# EAGLE schematic Electrics (EAGLE 9.6.2)
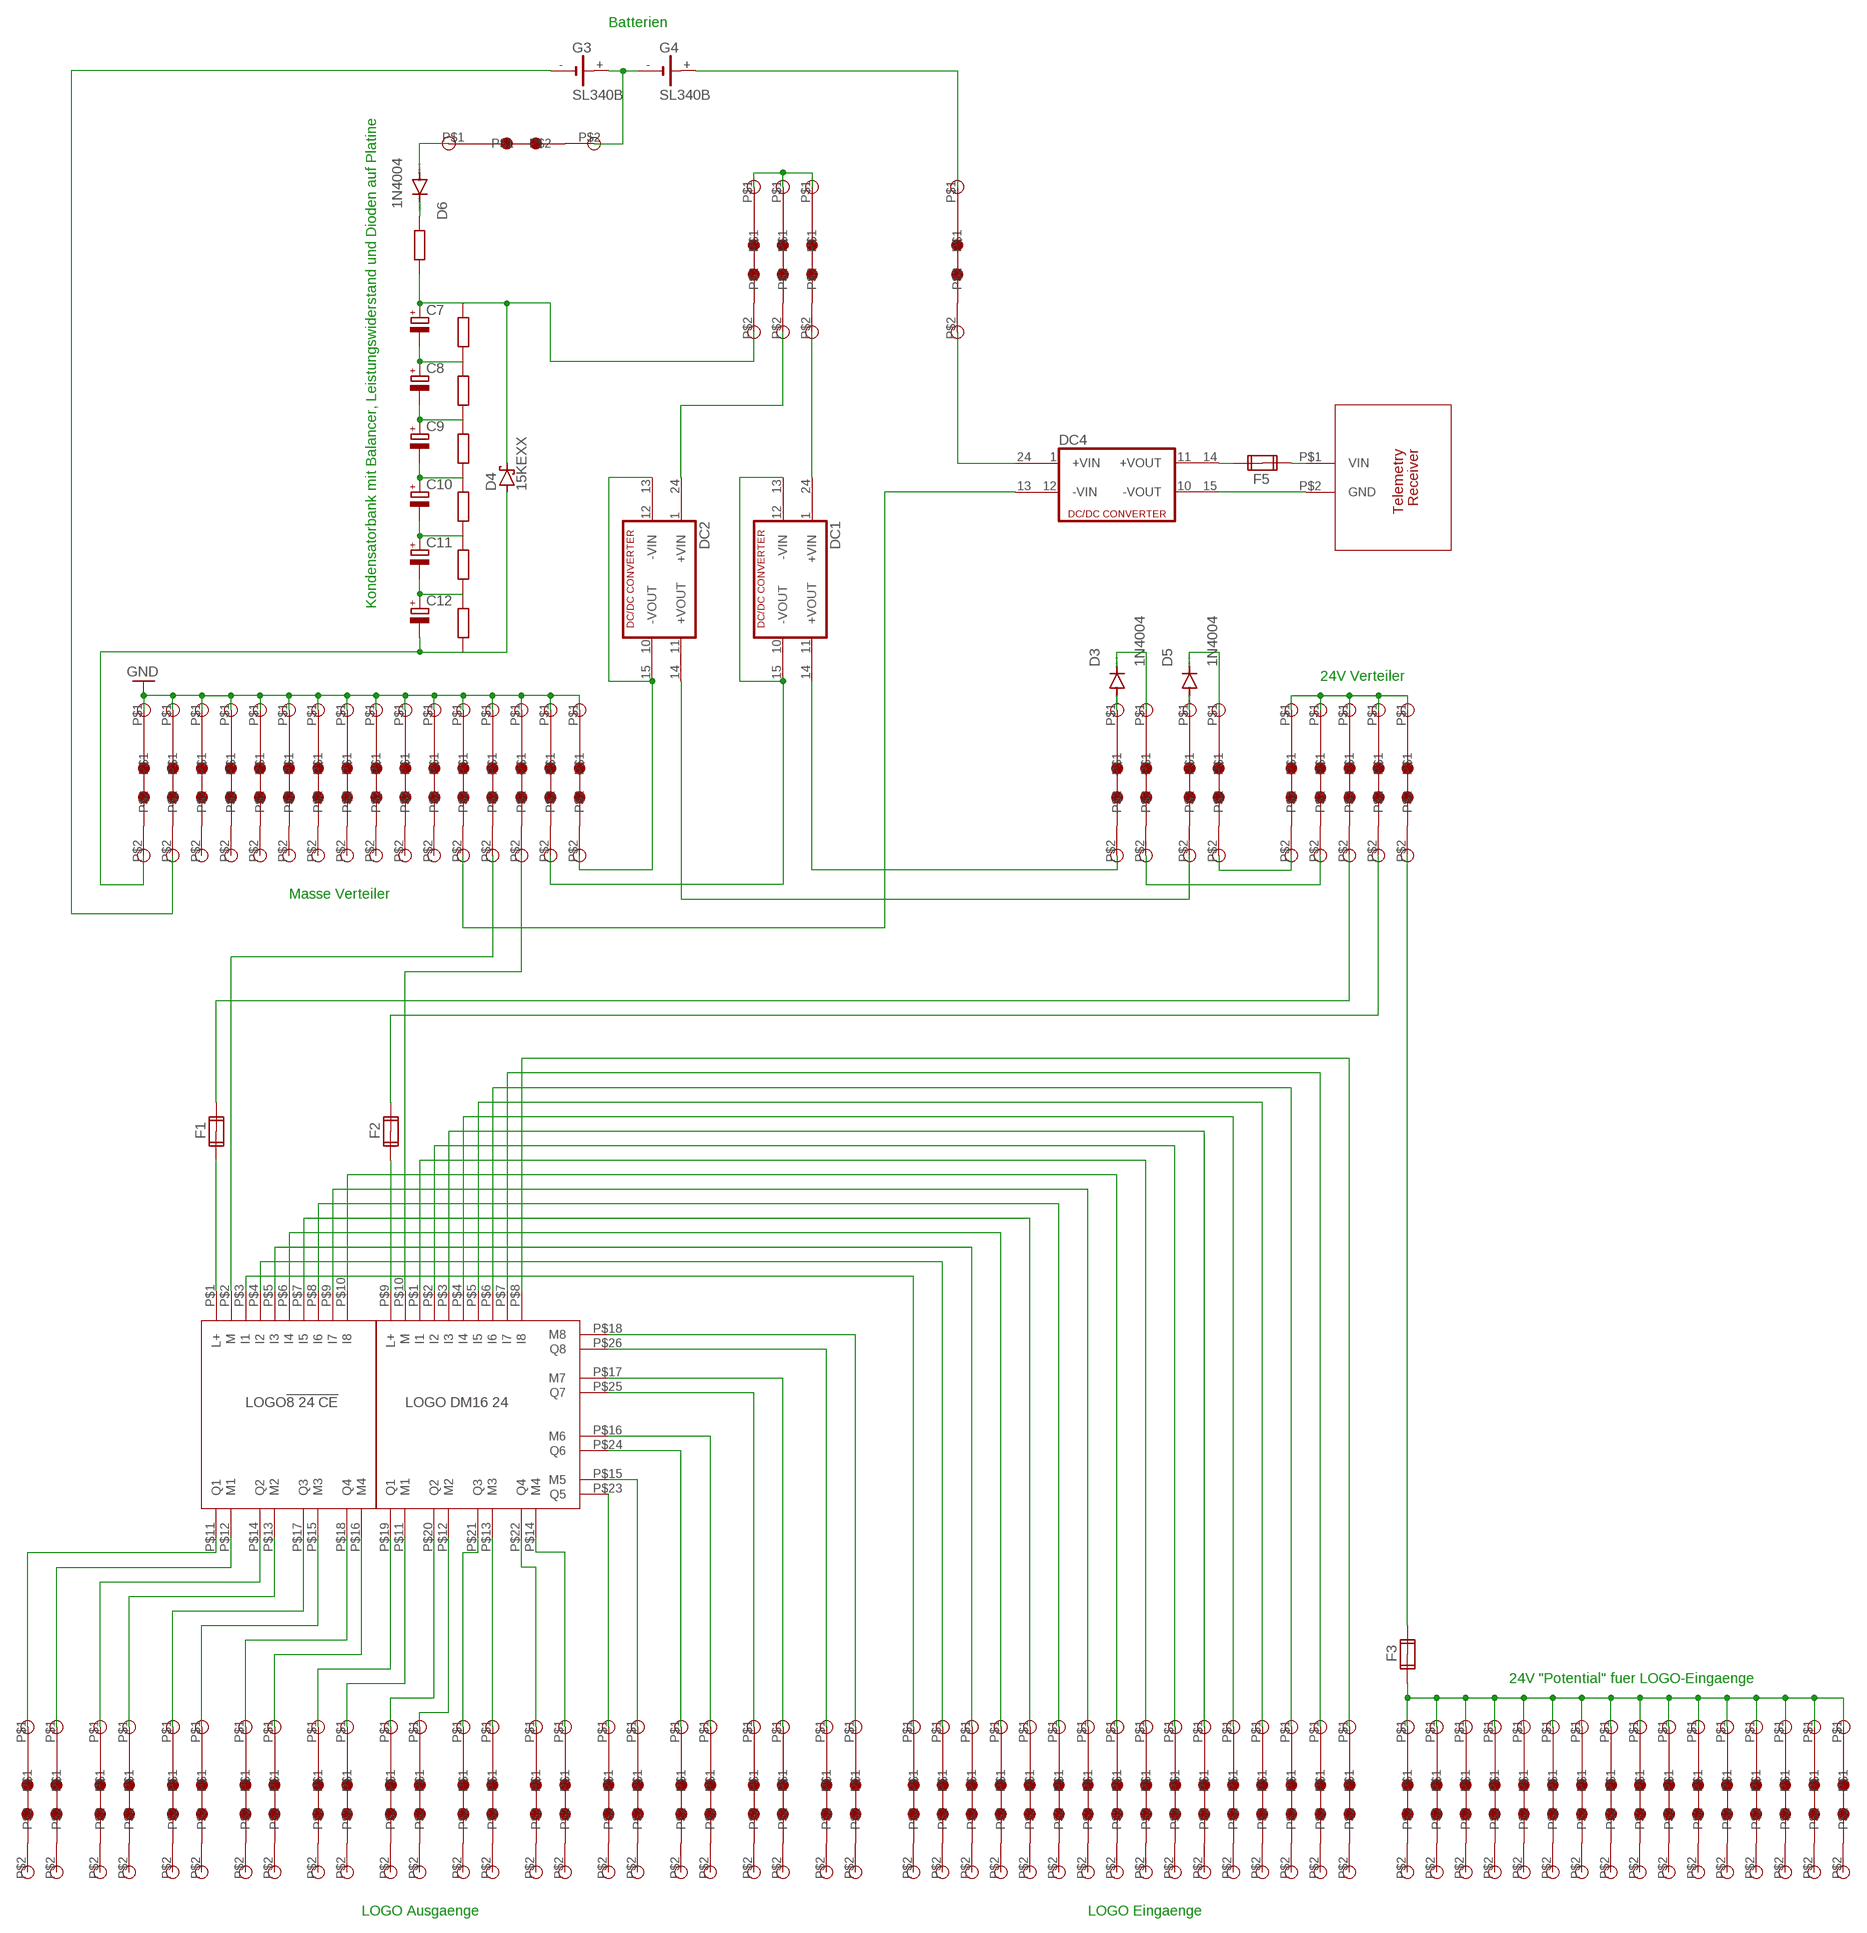
[diagram p0: schematic, sheet 1]

## Parts
C7  CPOL-EU085CS-1AR  [085CS_1AR]
C8  CPOL-EU085CS-1AR  [085CS_1AR]
C9  CPOL-EU085CS-1AR  [085CS_1AR]
C10  CPOL-EU085CS-1AR  [085CS_1AR]
C11  CPOL-EU085CS-1AR  [085CS_1AR]
C12  CPOL-EU085CS-1AR  [085CS_1AR]
D3  1N4004  [DO41-10]
D4  15KEXX  [CB429-17]
D5  1N4004  [DO41-10]
D6  1N4004  [DO41-10]
DC1  DC213R  [CMK]
DC2  DC213R  [CMK]
DC4  DC213R  [CMK]
F1  FUSE2P  [FUSE1]
F2  FUSE2P  [FUSE1]
F3  FUSE2P  [FUSE1]
F5  FUSE2P  [FUSE1]
G3  SL340B  [SL-340/B3.6V]
G4  SL340B  [SL-340/B3.6V]
U$1  2_PIN_CONNENCTOR  [2_PIN_CONN]
U$2  2_PIN_CONNENCTOR  [2_PIN_CONN]
U$3  2_PIN_CONNENCTOR  [2_PIN_CONN]
U$4  2_PIN_CONNENCTOR  [2_PIN_CONN]
U$5  LOGO8_24_CE  [LOGO8_24_CE]
U$7  LOGO_DM16_24  [LOGO_DM16_24]
U$8  2_PIN_CONNENCTOR  [2_PIN_CONN]
U$9  2_PIN_CONNENCTOR  [2_PIN_CONN]
U$10  2_PIN_CONNENCTOR  [2_PIN_CONN]
U$11  2_PIN_CONNENCTOR  [2_PIN_CONN]
U$12  2_PIN_CONNENCTOR  [2_PIN_CONN]
U$13  2_PIN_CONNENCTOR  [2_PIN_CONN]
U$14  2_PIN_CONNENCTOR  [2_PIN_CONN]
U$15  2_PIN_CONNENCTOR  [2_PIN_CONN]
U$16  2_PIN_CONNENCTOR  [2_PIN_CONN]
U$17  2_PIN_CONNENCTOR  [2_PIN_CONN]
U$18  2_PIN_CONNENCTOR  [2_PIN_CONN]
U$19  2_PIN_CONNENCTOR  [2_PIN_CONN]
U$20  2_PIN_CONNENCTOR  [2_PIN_CONN]
U$21  2_PIN_CONNENCTOR  [2_PIN_CONN]
U$22  2_PIN_CONNENCTOR  [2_PIN_CONN]
U$23  2_PIN_CONNENCTOR  [2_PIN_CONN]
U$24  2_PIN_CONNENCTOR  [2_PIN_CONN]
U$25  2_PIN_CONNENCTOR  [2_PIN_CONN]
U$26  2_PIN_CONNENCTOR  [2_PIN_CONN]
U$27  2_PIN_CONNENCTOR  [2_PIN_CONN]
U$28  2_PIN_CONNENCTOR  [2_PIN_CONN]
U$29  2_PIN_CONNENCTOR  [2_PIN_CONN]
U$30  2_PIN_CONNENCTOR  [2_PIN_CONN]
U$31  2_PIN_CONNENCTOR  [2_PIN_CONN]
U$32  2_PIN_CONNENCTOR  [2_PIN_CONN]
U$33  2_PIN_CONNENCTOR  [2_PIN_CONN]
U$34  2_PIN_CONNENCTOR  [2_PIN_CONN]
U$35  2_PIN_CONNENCTOR  [2_PIN_CONN]
U$36  2_PIN_CONNENCTOR  [2_PIN_CONN]
U$37  2_PIN_CONNENCTOR  [2_PIN_CONN]
U$38  2_PIN_CONNENCTOR  [2_PIN_CONN]
U$39  2_PIN_CONNENCTOR  [2_PIN_CONN]
U$40  2_PIN_CONNENCTOR  [2_PIN_CONN]
U$41  2_PIN_CONNENCTOR  [2_PIN_CONN]
U$42  2_PIN_CONNENCTOR  [2_PIN_CONN]
U$43  2_PIN_CONNENCTOR  [2_PIN_CONN]
U$44  2_PIN_CONNENCTOR  [2_PIN_CONN]
U$45  2_PIN_CONNENCTOR  [2_PIN_CONN]
U$46  2_PIN_CONNENCTOR  [2_PIN_CONN]
U$47  2_PIN_CONNENCTOR  [2_PIN_CONN]
U$48  2_PIN_CONNENCTOR  [2_PIN_CONN]
U$49  2_PIN_CONNENCTOR  [2_PIN_CONN]
U$50  2_PIN_CONNENCTOR  [2_PIN_CONN]
U$51  2_PIN_CONNENCTOR  [2_PIN_CONN]
U$52  2_PIN_CONNENCTOR  [2_PIN_CONN]
U$53  2_PIN_CONNENCTOR  [2_PIN_CONN]
U$54  2_PIN_CONNENCTOR  [2_PIN_CONN]
U$55  2_PIN_CONNENCTOR  [2_PIN_CONN]
U$56  2_PIN_CONNENCTOR  [2_PIN_CONN]
U$57  2_PIN_CONNENCTOR  [2_PIN_CONN]
U$58  2_PIN_CONNENCTOR  [2_PIN_CONN]
U$59  2_PIN_CONNENCTOR  [2_PIN_CONN]
U$60  2_PIN_CONNENCTOR  [2_PIN_CONN]
U$61  2_PIN_CONNENCTOR  [2_PIN_CONN]
U$62  2_PIN_CONNENCTOR  [2_PIN_CONN]
U$63  2_PIN_CONNENCTOR  [2_PIN_CONN]
U$64  2_PIN_CONNENCTOR  [2_PIN_CONN]
U$65  2_PIN_CONNENCTOR  [2_PIN_CONN]
U$66  2_PIN_CONNENCTOR  [2_PIN_CONN]
U$67  2_PIN_CONNENCTOR  [2_PIN_CONN]
U$68  2_PIN_CONNENCTOR  [2_PIN_CONN]
U$69  2_PIN_CONNENCTOR  [2_PIN_CONN]
U$70  2_PIN_CONNENCTOR  [2_PIN_CONN]
U$71  2_PIN_CONNENCTOR  [2_PIN_CONN]
U$72  2_PIN_CONNENCTOR  [2_PIN_CONN]
U$73  2_PIN_CONNENCTOR  [2_PIN_CONN]
U$74  2_PIN_CONNENCTOR  [2_PIN_CONN]
U$75  2_PIN_CONNENCTOR  [2_PIN_CONN]
U$76  2_PIN_CONNENCTOR  [2_PIN_CONN]
U$77  2_PIN_CONNENCTOR  [2_PIN_CONN]
U$78  2_PIN_CONNENCTOR  [2_PIN_CONN]
U$79  2_PIN_CONNENCTOR  [2_PIN_CONN]
U$80  2_PIN_CONNENCTOR  [2_PIN_CONN]
U$81  2_PIN_CONNENCTOR  [2_PIN_CONN]
U$82  2_PIN_CONNENCTOR  [2_PIN_CONN]
U$83  2_PIN_CONNENCTOR  [2_PIN_CONN]
U$84  2_PIN_CONNENCTOR  [2_PIN_CONN]
U$85  2_PIN_CONNENCTOR  [2_PIN_CONN]
U$86  2_PIN_CONNENCTOR  [2_PIN_CONN]
U$87  2_PIN_CONNENCTOR  [2_PIN_CONN]
U$89  2_PIN_CONNENCTOR  [2_PIN_CONN]
U$90  TELEMETRY_RECEIVER  [TELEMETRY_RECEIVER]
U$91  2_PIN_CONNENCTOR  [2_PIN_CONN]

## Nets
GND: U$69.P$1 U$70.P$1 U$71.P$1 U$72.P$1 U$73.P$1 U$74.P$1 U$75.P$1 U$76.P$1 U$77.P$1 U$78.P$1 U$79.P$1 U$80.P$1 U$81.P$1 U$82.P$1 U$83.P$1 U$84.P$1
GND1: C12.- D4.A U$69.P$2
N$1: C7.+ D4.C U$85.P$2
N$2: DC4.24(+VIN1) U$89.P$2
N$3: G3.- U$70.P$2
N$4: G4.+ U$89.P$1
N$5: DC4.14(+VOUT1) F5.2A
N$6: F5.1A U$90.P$1(VIN)
N$7: DC4.15(-VOUT1) U$90.P$2(GND)
N$8: DC4.13(-VIN1) U$80.P$2
N$9: DC1.14(+VOUT1) U$65.P$2
N$10: D6.A U$91.P$1
N$11: DC2.14(+VOUT1) U$67.P$2
N$12: D3.A U$65.P$1
N$14: U$1.P$1 U$5.P$11(Q1)
N$15: U$2.P$1 U$5.P$12(M1)
N$16: U$3.P$1 U$5.P$14(Q2)
N$17: U$4.P$1 U$5.P$13(M2)
N$18: U$5.P$17(Q3) U$8.P$1
N$19: U$5.P$15(M3) U$9.P$1
N$20: U$5.P$18(Q4) U$10.P$1
N$21: U$5.P$16(M4) U$11.P$1
N$22: U$7.P$19(Q1) U$12.P$1
N$23: U$7.P$11(M1) U$13.P$1
N$24: U$7.P$20(Q2) U$14.P$1
N$25: U$7.P$12(M2) U$15.P$1
N$26: U$7.P$21(Q3) U$16.P$1
N$27: U$7.P$13(M3) U$17.P$1
N$28: U$7.P$22(Q4) U$18.P$1
N$29: U$7.P$14(M4) U$19.P$1
N$30: U$7.P$23(Q5) U$20.P$1
N$31: U$7.P$15(M5) U$21.P$1
N$32: U$7.P$24(Q6) U$22.P$1
N$33: U$7.P$16(M6) U$23.P$1
N$34: U$7.P$25(Q7) U$24.P$1
N$35: U$7.P$17(M7) U$25.P$1
N$36: U$7.P$26(Q8) U$26.P$1
N$37: U$7.P$18(M8) U$27.P$1
N$38: U$5.P$3(I1) U$28.P$1
N$39: U$5.P$4(I2) U$29.P$1
N$40: U$5.P$5(I3) U$30.P$1
N$41: U$5.P$6(I4) U$31.P$1
N$42: U$5.P$7(I5) U$32.P$1
N$43: U$5.P$8(I6) U$33.P$1
N$44: U$5.P$9(I7) U$34.P$1
N$45: U$5.P$10(I8) U$35.P$1
N$46: U$7.P$1(I1) U$36.P$1
N$47: U$7.P$2(I2) U$37.P$1
N$48: U$7.P$3(I3) U$38.P$1
N$49: U$7.P$4(I4) U$39.P$1
N$50: U$7.P$5(I5) U$40.P$1
N$51: U$7.P$6(I6) U$41.P$1
N$52: U$7.P$7(I7) U$42.P$1
N$53: U$7.P$8(I8) U$43.P$1
N$54: F2.2A U$63.P$2
N$55: F1.1A U$5.P$1(L+)
N$56: F3.1A U$44.P$1 U$45.P$1 U$46.P$1 U$47.P$1 U$48.P$1 U$49.P$1 U$50.P$1 U$51.P$1 U$52.P$1 U$53.P$1 U$54.P$1 U$55.P$1 U$56.P$1 U$57.P$1 U$58.P$1 U$59.P$1
N$57: F1.2A U$62.P$2
N$58: F2.1A U$7.P$9(L+)
N$60: F3.2A U$64.P$2
N$61: U$60.P$1 U$61.P$1 U$62.P$1 U$63.P$1 U$64.P$1
N$62: U$85.P$1 U$86.P$1 U$87.P$1
N$63: D3.C U$66.P$1
N$64: U$7.P$10(M) U$82.P$2
N$65: D5.A U$67.P$1
N$66: D5.C U$68.P$1
N$67: U$60.P$2 U$68.P$2
N$68: U$61.P$2 U$66.P$2
N$69: U$5.P$2(M) U$81.P$2
N$70: DC2.13(-VIN1) DC2.15(-VOUT1) U$84.P$2
N$71: DC1.13(-VIN1) DC1.15(-VOUT1) U$83.P$2
N$72: DC1.24(+VIN1) U$87.P$2
N$73: DC2.24(+VIN1) U$86.P$2
N$74: G3.+ G4.- U$91.P$2
N$76: C7.- C8.+
N$77: C8.- C9.+
N$78: C9.- C10.+
N$79: C10.- C11.+
N$80: C11.- C12.+
N$82: D6.C
Unconnected: DC1.1(+VIN) DC1.10(-VOUT) DC1.11(+VOUT) DC1.12(-VIN) DC2.1(+VIN) DC2.10(-VOUT) DC2.11(+VOUT) DC2.12(-VIN) DC4.1(+VIN) DC4.10(-VOUT) DC4.11(+VOUT) DC4.12(-VIN) F1.1B F1.2B F2.1B F2.2B F3.1B F3.2B F5.1B F5.2B U$1.P$2 U$2.P$2 U$3.P$2 U$4.P$2 U$8.P$2 U$9.P$2 U$10.P$2 U$11.P$2 U$12.P$2 U$13.P$2 U$14.P$2 U$15.P$2 U$16.P$2 U$17.P$2 U$18.P$2 U$19.P$2 U$20.P$2 U$21.P$2 U$22.P$2 U$23.P$2 U$24.P$2 U$25.P$2 U$26.P$2 U$27.P$2 U$28.P$2 U$29.P$2 U$30.P$2 U$31.P$2 U$32.P$2 U$33.P$2 U$34.P$2 U$35.P$2 U$36.P$2 U$37.P$2 U$38.P$2 U$39.P$2 U$40.P$2 U$41.P$2 U$42.P$2 U$43.P$2 U$44.P$2 U$45.P$2 U$46.P$2 U$47.P$2 U$48.P$2 U$49.P$2 U$50.P$2 U$51.P$2 U$52.P$2 U$53.P$2 U$54.P$2 U$55.P$2 U$56.P$2 U$57.P$2 U$58.P$2 U$59.P$2 U$71.P$2 U$72.P$2 U$73.P$2 U$74.P$2 U$75.P$2 U$76.P$2 U$77.P$2 U$78.P$2 U$79.P$2

## Notes on the sheet
- Batterien
- Kondensatorbank mit Balancer, Leistungswiderstand und Dioden auf Platine
- 24V Verteiler
- Masse Verteiler
- 24V "Potential" fuer LOGO-Eingaenge
- LOGO Ausgaenge | LOGO Eingaenge

## Library data of the parts
C7-C12 = rcl:CPOL-EU: POLARIZED CAPACITOR, European symbol; SPICEPREFIX: C
D3 D5 D6 = diode:1N4004: DIODE general purpose rectifier, 1 A
D4 = diode:15KEXX: DIODE
DC1 DC2 DC4 = dc-dc-converter:DC213R: DC-DC CONVERTER; OC_FARNELL: unknown; OC_NEWARK: unknown
F1-F3 F5 = special:FUSE2P: FUSE 5 x 20 mm
G3 G4 = battery:SL340B: LI BATTERY Sonnenschein SL-340 B 3.6 V
U$1-U$4 U$8-U$87 U$89 U$91 = connectors:2_PIN_CONNENCTOR
U$5 = LOGO:LOGO8_24_CE
U$7 = LOGO:LOGO_DM16_24
U$90 = telemetry:TELEMETRY_RECEIVER